# Altium schematic sheet Project_Information.SchDoc: =project_title
size Tabloid; CompanyName: Luxonis Holding; Organization: Luxonis Holding; Address1: 1925 Harmony Park Drive; Address2: Westminster, CO; Address3: 80234; Address4: United States; SheetNumber: 1; SheetTotal: 12
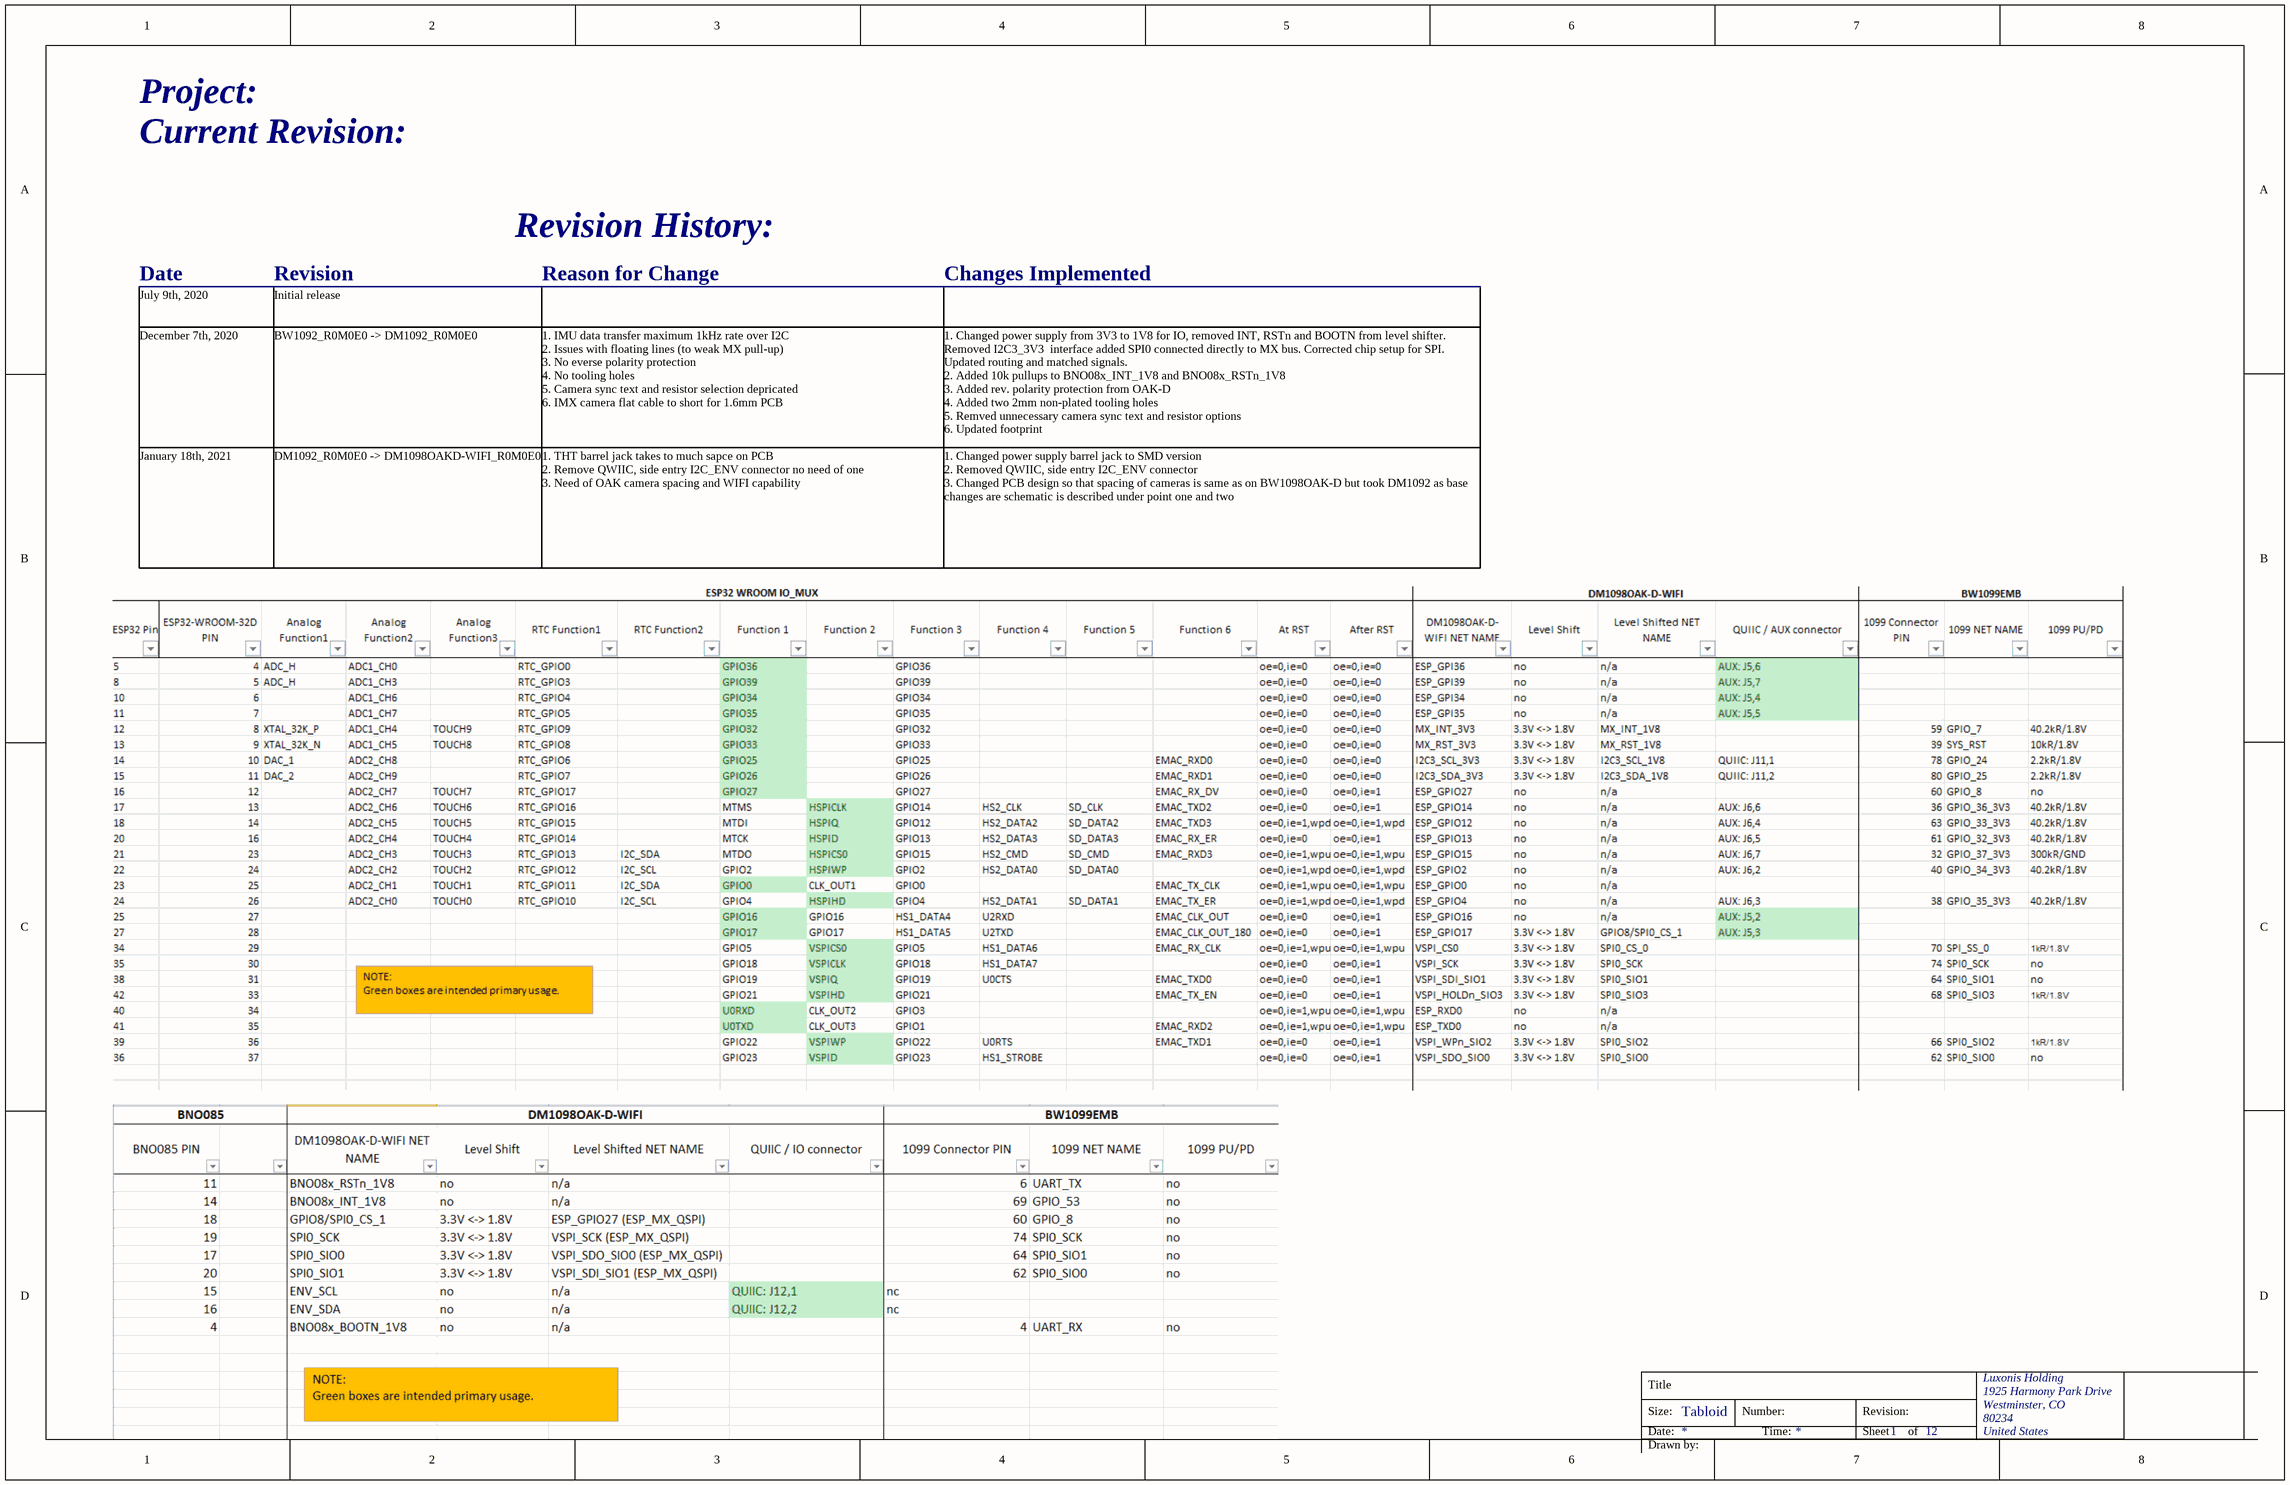
[diagram p0: Project_Information.SchDoc]

## Notes on the sheet
- Project:
- Current Revision:
- Date
- Revision
- Revision History:
- Reason for Change
- Changes Implemented
- July 9th, 2020
- Initial release
- December 7th, 2020
- BW1092_R0M0E0 -> DM1092_R0M0E0
- 1. IMU data transfer maximum 1kHz rate over I2C
  2. Issues with floating lines (to weak MX pull-up)
  3. No everse polarity protection
  4. No tooling holes
  5. Camera sync text and resistor selection depricated
  6. IMX camera flat cable to short for 1.6mm PCB
- 1. Changed power supply from 3V3 to 1V8 for IO, removed INT, RSTn and BOOTN from level shifter. Removed I2C3_3V3  interface added SPI0 connected directly to MX bus. Corrected chip setup for SPI. Updated routing and matched signals.
  2. Added 10k pullups to BNO08x_INT_1V8 and BNO08x_RSTn_1V8
  3. Added rev. polarity protection from OAK-D
  4. Added two 2mm non-plated tooling holes
  5. Remved unnecessary camera sync text and resistor options
  6. Updated footprint
- January 18th, 2021
- DM1092_R0M0E0 -> DM1098OAKD-WIFI_R0M0E0
- 1. THT barrel jack takes to much sapce on PCB
  2. Remove QWIIC, side entry I2C_ENV connector no need of one
  3. Need of OAK camera spacing and WIFI capability
- 1. Changed power supply barrel jack to SMD version
  2. Removed QWIIC, side entry I2C_ENV connector
  3. Changed PCB design so that spacing of cameras is same as on BW1098OAK-D but took DM1092 as base changes are schematic is described under point one and two
- Title
- Size:
- Date:
- Tabloid
- Number:
- Time:
- Revision:
- Sheet
- of
- Drawn by: